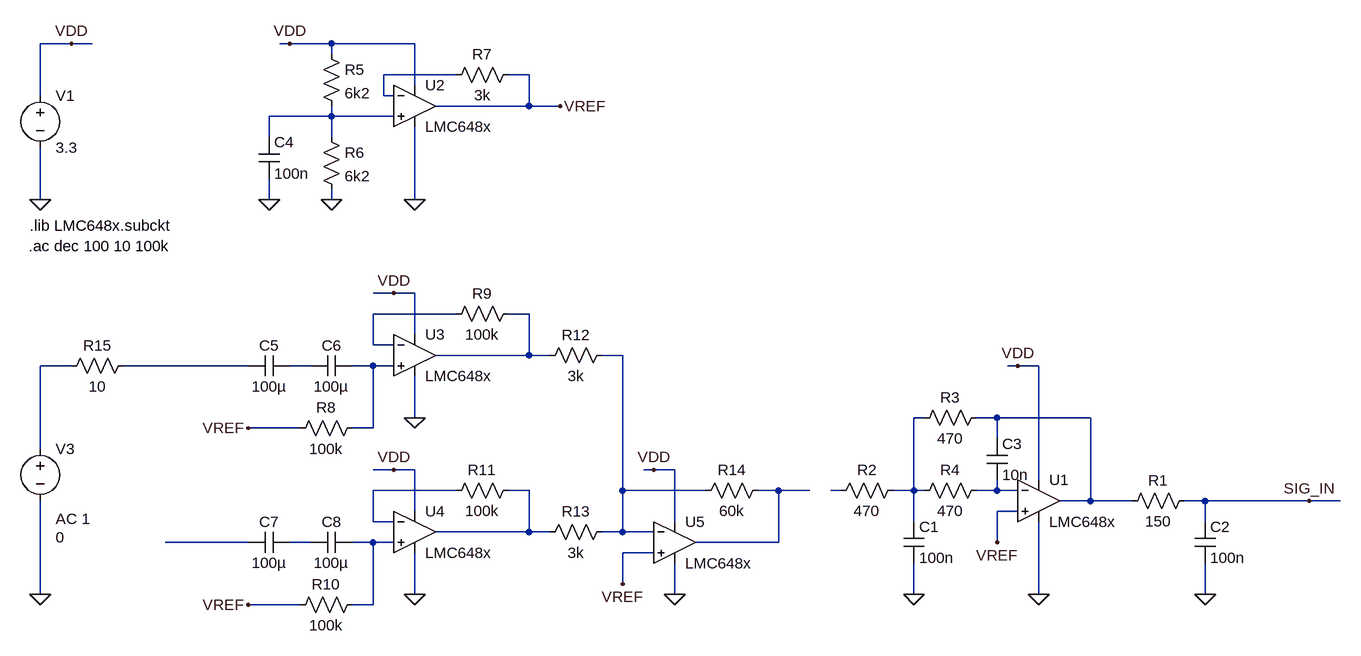
[diagram p0: schematic Multiple Feedback.asc]
Multiple Feedback.asc, the LTspice schematic file:
Version 4
SHEET 1 1032 792
WIRE -1088 -240 -1136 -240
WIRE -1056 -240 -1088 -240
WIRE -752 -240 -768 -240
WIRE -688 -240 -752 -240
WIRE -560 -240 -688 -240
WIRE -688 -224 -688 -240
WIRE -496 -192 -608 -192
WIRE -384 -192 -416 -192
WIRE -560 -176 -560 -240
WIRE -1136 -160 -1136 -240
WIRE -608 -160 -608 -192
WIRE -592 -160 -608 -160
WIRE -384 -144 -384 -192
WIRE -384 -144 -528 -144
WIRE -336 -144 -384 -144
WIRE -688 -128 -688 -144
WIRE -688 -128 -784 -128
WIRE -592 -128 -688 -128
WIRE -784 -96 -784 -128
WIRE -688 -96 -688 -128
WIRE -1136 0 -1136 -80
WIRE -784 0 -784 -32
WIRE -688 0 -688 -16
WIRE -560 0 -560 -112
WIRE -592 144 -624 144
WIRE -560 144 -592 144
WIRE -496 176 -624 176
WIRE -384 176 -416 176
WIRE -560 208 -560 144
WIRE -624 224 -624 176
WIRE -592 224 -624 224
WIRE -384 240 -384 176
WIRE -384 240 -528 240
WIRE -352 240 -384 240
WIRE -240 240 -272 240
WIRE -1088 256 -1136 256
WIRE -816 256 -1008 256
WIRE -720 256 -752 256
WIRE -624 256 -656 256
WIRE -592 256 -624 256
WIRE 368 256 352 256
WIRE 400 256 368 256
WIRE -560 336 -560 272
WIRE 224 336 208 336
WIRE 336 336 304 336
WIRE 480 336 336 336
WIRE -736 352 -816 352
WIRE -624 352 -624 256
WIRE -624 352 -656 352
WIRE 336 368 336 336
WIRE -1136 384 -1136 256
WIRE -592 416 -624 416
WIRE -560 416 -592 416
WIRE -192 416 -208 416
WIRE -160 416 -192 416
WIRE 400 432 400 256
WIRE -496 448 -624 448
WIRE -384 448 -416 448
WIRE -240 448 -240 240
WIRE -112 448 -240 448
WIRE 0 448 -32 448
WIRE 48 448 0 448
WIRE 96 448 80 448
WIRE 208 448 208 336
WIRE 208 448 176 448
WIRE 224 448 208 448
WIRE 336 448 336 432
WIRE 336 448 304 448
WIRE 368 448 336 448
WIRE 480 464 480 336
WIRE 480 464 432 464
WIRE 544 464 480 464
WIRE 656 464 624 464
WIRE 816 464 656 464
WIRE 864 464 816 464
WIRE -560 480 -560 416
WIRE 368 480 336 480
WIRE -624 496 -624 448
WIRE -592 496 -624 496
WIRE -160 496 -160 416
WIRE 208 496 208 448
WIRE 656 496 656 464
WIRE -384 512 -384 448
WIRE -384 512 -528 512
WIRE -352 512 -384 512
WIRE -240 512 -240 448
WIRE -240 512 -272 512
WIRE -192 512 -240 512
WIRE -816 528 -944 528
WIRE -720 528 -752 528
WIRE -624 528 -656 528
WIRE -592 528 -624 528
WIRE 0 528 0 448
WIRE 0 528 -128 528
WIRE 336 528 336 480
WIRE -192 544 -240 544
WIRE -240 592 -240 544
WIRE -1136 608 -1136 464
WIRE -560 608 -560 544
WIRE -160 608 -160 560
WIRE 208 608 208 560
WIRE 400 608 400 496
WIRE 656 608 656 560
WIRE -736 624 -816 624
WIRE -624 624 -624 528
WIRE -624 624 -656 624
FLAG -1136 0 0
FLAG -1088 -240 VDD
FLAG 400 608 0
FLAG 368 256 VDD
FLAG 656 608 0
FLAG 208 608 0
FLAG -688 0 0
FLAG -784 0 0
FLAG -560 0 0
FLAG -752 -240 VDD
FLAG -336 -144 VREF
FLAG 336 528 VREF
FLAG -560 336 0
FLAG -592 144 VDD
FLAG -816 352 VREF
FLAG -560 608 0
FLAG -592 416 VDD
FLAG -816 624 VREF
FLAG -1136 608 0
FLAG -240 592 VREF
FLAG -160 608 0
FLAG -192 416 VDD
FLAG 816 464 SIG_IN
SYMBOL voltage -1136 -176 R0
WINDOW 123 0 0 Left 0
WINDOW 39 0 0 Left 0
SYMATTR InstName V1
SYMATTR Value 3.3
SYMBOL res 192 432 R90
WINDOW 0 0 56 VBottom 2
WINDOW 3 32 56 VTop 2
SYMATTR InstName R2
SYMATTR Value 470
SYMBOL res 640 448 R90
WINDOW 0 0 56 VBottom 2
WINDOW 3 32 56 VTop 2
SYMATTR InstName R1
SYMATTR Value 150
SYMBOL cap 192 496 R0
SYMATTR InstName C1
SYMATTR Value 100n
SYMBOL cap 640 496 R0
SYMATTR InstName C2
SYMATTR Value 100n
SYMBOL cap 320 368 R0
SYMATTR InstName C3
SYMATTR Value 10n
SYMBOL res 320 320 R90
WINDOW 0 0 56 VBottom 2
WINDOW 3 32 56 VTop 2
SYMATTR InstName R3
SYMATTR Value 470
SYMBOL res 320 432 R90
WINDOW 0 0 56 VBottom 2
WINDOW 3 32 56 VTop 2
SYMATTR InstName R4
SYMATTR Value 470
SYMBOL OpAmps\\opamp2 400 400 R0
SYMATTR InstName U1
SYMATTR Value LMC648x
SYMBOL OpAmps\\opamp2 -560 -208 R0
SYMATTR InstName U2
SYMATTR Value LMC648x
SYMBOL res -704 -240 R0
SYMATTR InstName R5
SYMATTR Value 6k2
SYMBOL res -704 -112 R0
SYMATTR InstName R6
SYMATTR Value 6k2
SYMBOL cap -800 -96 R0
SYMATTR InstName C4
SYMATTR Value 100n
SYMBOL res -400 -208 R90
WINDOW 0 0 56 VBottom 2
WINDOW 3 32 56 VTop 2
SYMATTR InstName R7
SYMATTR Value 3k
SYMBOL voltage -1136 368 R0
WINDOW 3 24 152 Left 2
WINDOW 123 24 124 Left 2
WINDOW 39 0 0 Left 0
SYMATTR InstName V3
SYMATTR Value 0
SYMATTR Value2 AC 1
SYMBOL cap -752 240 R90
WINDOW 0 0 32 VBottom 2
WINDOW 3 32 32 VTop 2
SYMATTR InstName C5
SYMATTR Value 100µ
SYMBOL cap -656 240 R90
WINDOW 0 0 32 VBottom 2
WINDOW 3 32 32 VTop 2
SYMATTR InstName C6
SYMATTR Value 100µ
SYMBOL res -640 336 R90
WINDOW 0 0 56 VBottom 2
WINDOW 3 32 56 VTop 2
SYMATTR InstName R8
SYMATTR Value 100k
SYMBOL OpAmps\\opamp2 -560 176 R0
SYMATTR InstName U3
SYMATTR Value LMC648x
SYMBOL res -400 160 R90
WINDOW 0 0 56 VBottom 2
WINDOW 3 32 56 VTop 2
SYMATTR InstName R9
SYMATTR Value 100k
SYMBOL cap -752 512 R90
WINDOW 0 0 32 VBottom 2
WINDOW 3 32 32 VTop 2
SYMATTR InstName C7
SYMATTR Value 100µ
SYMBOL cap -656 512 R90
WINDOW 0 0 32 VBottom 2
WINDOW 3 32 32 VTop 2
SYMATTR InstName C8
SYMATTR Value 100µ
SYMBOL res -640 608 R90
WINDOW 0 0 56 VBottom 2
WINDOW 3 32 56 VTop 2
SYMATTR InstName R10
SYMATTR Value 100k
SYMBOL OpAmps\\opamp2 -560 448 R0
SYMATTR InstName U4
SYMATTR Value LMC648x
SYMBOL res -400 432 R90
WINDOW 0 0 56 VBottom 2
WINDOW 3 32 56 VTop 2
SYMATTR InstName R11
SYMATTR Value 100k
SYMBOL res -256 224 R90
WINDOW 0 0 56 VBottom 2
WINDOW 3 32 56 VTop 2
SYMATTR InstName R12
SYMATTR Value 3k
SYMBOL res -256 496 R90
WINDOW 0 0 56 VBottom 2
WINDOW 3 32 56 VTop 2
SYMATTR InstName R13
SYMATTR Value 3k
SYMBOL OpAmps\\opamp2 -160 464 R0
SYMATTR InstName U5
SYMATTR Value LMC648x
SYMBOL res -16 432 R90
WINDOW 0 0 56 VBottom 2
WINDOW 3 32 56 VTop 2
SYMATTR InstName R14
SYMATTR Value 60k
SYMBOL res -992 240 R90
WINDOW 0 0 56 VBottom 2
WINDOW 3 32 56 VTop 2
SYMATTR InstName R15
SYMATTR Value 10
TEXT -1152 40 Left 2 !.lib LMC648x.subckt
TEXT -1154 72 Left 2 !.ac dec 100 10 100k

The netlist it stands for:
* Multiple Feedback.asc
V1 VDD 0 3.3
R2 N010 N015 470
R1 SIG_IN N011 150
C1 N010 0 100n
C2 SIG_IN 0 100n
C3 N011 N016 10n
R3 N011 N010 470
R4 N016 N010 470
XU1 VREF N016 VDD 0 N011 LMC648x  ; pins In+ In- V+ V- OUT
XU2 N002 N001 VDD 0 VREF LMC648x  ; pins In+ In- V+ V- OUT
R5 VDD N002 6k2
R6 N002 0 6k2
C4 N002 0 100n
R7 VREF N001 3k
V3 N006 0 0 AC 1
C5 N008 N007 100µ
C6 N009 N008 100µ
R8 N009 VREF 100k
XU3 N009 N003 VDD 0 N004 LMC648x  ; pins In+ In- V+ V- OUT
R9 N004 N003 100k
C7 N018 N017 100µ
C8 N019 N018 100µ
R10 N019 VREF 100k
XU4 N019 N012 VDD 0 N013 LMC648x  ; pins In+ In- V+ V- OUT
R11 N013 N012 100k
R12 N005 N004 3k
R13 N005 N013 3k
XU5 VREF N005 VDD 0 N014 LMC648x  ; pins In+ In- V+ V- OUT
R14 N014 N005 60k
R15 N007 N006 10
.lib LMC648x.subckt
.ac dec 100 10 100k
.backanno
.end